# Altium schematic sheet Breakout to AHD Shield.SchDoc
size A
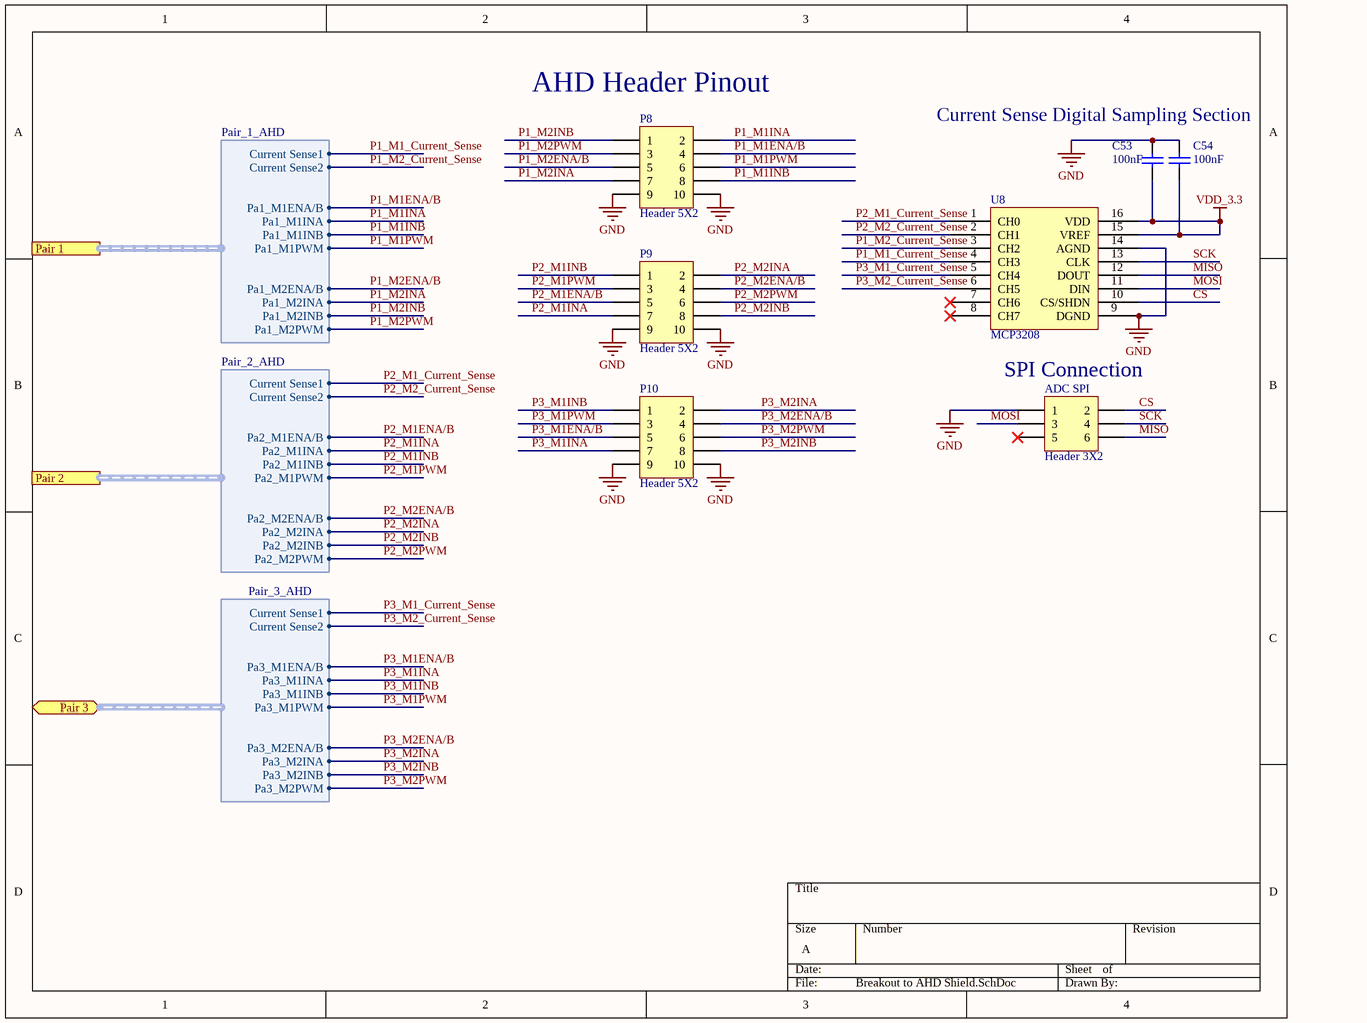
[diagram p0: Breakout to AHD Shield.SchDoc]

## Parts
ADC_SPI  Header 3X2  [HDR2X3]
C53  value 100nF  [C1206]  (hidden comment: Cap Semi)
C54  value 100nF  [C1206]  (hidden comment: Cap Semi)
P8  Header 5X2  [HDR2X5]
P9  Header 5X2  [HDR2X5]
P10  Header 5X2  [HDR2X5]
U8  MCP3208  [MCP3208 - duplicate]

## Ports
Pair 1 (harness Pair_1_AHD), Pair 2 (harness Pair_2_AHD), Pair 3 (harness Pair_3_AHD)

## Harnesses
Pair_1_AHD: Current Sense1, Current Sense2, Pa1_M1ENA/B, Pa1_M1INA, Pa1_M1INB, Pa1_M1PWM, Pa1_M2INA, Pa1_M2ENA/B, Pa1_M2INB, Pa1_M2PWM
Pair_2_AHD: Current Sense1, Current Sense2, Pa2_M1ENA/B, Pa2_M1INA, Pa2_M1INB, Pa2_M1PWM, Pa2_M2INA, Pa2_M2ENA/B, Pa2_M2INB, Pa2_M2PWM
Pair_3_AHD: Current Sense1, Current Sense2, Pa3_M1ENA/B, Pa3_M1INA, Pa3_M1INB, Pa3_M1PWM, Pa3_M2INA, Pa3_M2ENA/B, Pa3_M2INB, Pa3_M2PWM

## Nets
GND: ADC_SPI.1 C53.2 C54.2 P8.9 P8.10 P9.9 P9.10 P10.9 P10.10 U8.9(DGND) U8.14(AGND)
VDD_3.3: C53.1 C54.1 U8.15(VREF) U8.16(VDD)
CS: ADC_SPI.2 U8.10(CS/SHDN)
MISO: ADC_SPI.6 U8.12(DOUT)
MOSI: ADC_SPI.3 U8.11(DIN)
P1_M1_Current_Sense: U8.4(CH3) ; port Pair 1.Current Sense1
P1_M1ENA/B: P8.4 ; port Pair 1.Pa1_M1ENA/B
P1_M1INA: P8.2 ; port Pair 1.Pa1_M1INA
P1_M1INB: P8.8 ; port Pair 1.Pa1_M1INB
P1_M1PWM: P8.6 ; port Pair 1.Pa1_M1PWM
P1_M2_Current_Sense: U8.3(CH2) ; port Pair 1.Current Sense2
P1_M2ENA/B: P8.5 ; port Pair 1.Pa1_M2ENA/B
P1_M2INA: P8.7 ; port Pair 1.Pa1_M2INA
P1_M2INB: P8.1 ; port Pair 1.Pa1_M2INB
P1_M2PWM: P8.3 ; port Pair 1.Pa1_M2PWM
P2_M1_Current_Sense: U8.1(CH0) ; port Pair 2.Current Sense1
P2_M1ENA/B: P9.5 ; port Pair 2.Pa2_M1ENA/B
P2_M1INA: P9.7 ; port Pair 2.Pa2_M1INA
P2_M1INB: P9.1 ; port Pair 2.Pa2_M1INB
P2_M1PWM: P9.3 ; port Pair 2.Pa2_M1PWM
P2_M2_Current_Sense: U8.2(CH1) ; port Pair 2.Current Sense2
P2_M2ENA/B: P9.4 ; port Pair 2.Pa2_M2ENA/B
P2_M2INA: P9.2 ; port Pair 2.Pa2_M2INA
P2_M2INB: P9.8 ; port Pair 2.Pa2_M2INB
P2_M2PWM: P9.6 ; port Pair 2.Pa2_M2PWM
P3_M1_Current_Sense: U8.5(CH4) ; port Pair 3.Current Sense1
P3_M1ENA/B: P10.5 ; port Pair 3.Pa3_M1ENA/B
P3_M1INA: P10.7 ; port Pair 3.Pa3_M1INA
P3_M1INB: P10.1 ; port Pair 3.Pa3_M1INB
P3_M1PWM: P10.3 ; port Pair 3.Pa3_M1PWM
P3_M2_Current_Sense: U8.6(CH5) ; port Pair 3.Current Sense2
P3_M2ENA/B: P10.4 ; port Pair 3.Pa3_M2ENA/B
P3_M2INA: P10.2 ; port Pair 3.Pa3_M2INA
P3_M2INB: P10.8 ; port Pair 3.Pa3_M2INB
P3_M2PWM: P10.6 ; port Pair 3.Pa3_M2PWM
SCK: ADC_SPI.4 U8.13(CLK)

Not connected (* = marked no-connect by the designer): ADC_SPI 5*; U8 7(CH6)* 8(CH7)*

## Notes on the sheet
- (near P8) AHD Header Pinout
- Current Sense Digital Sampling Section
- SPI Connection

## Library data of the parts
ADC_SPI = Header 3X2: Header, 3-Pin, Dual row; LatestRevisionDate: 17-Jul-2002; LatestRevisionNote: Re-released for DXP Platform.; Publisher: Altium Limited
C53 C54 = Cap Semi: Capacitor (Semiconductor SIM Model); Published: 8-Jun-2000; LatestRevisionDate: 29-May-2009; LatestRevisionNote: IPC-7351 Footprint Added.; PackageReference: C1206; Publisher: Altium Limited; PackageDescription: Chip Capacitor
P8-P10 = Header 5X2: Header, 5-Pin, Dual row; LatestRevisionDate: 17-Jul-2002; LatestRevisionNote: Re-released for DXP Platform.; Publisher: Altium Limited